# EAGLE design USBasp_smd05 (EAGLE 4.16)
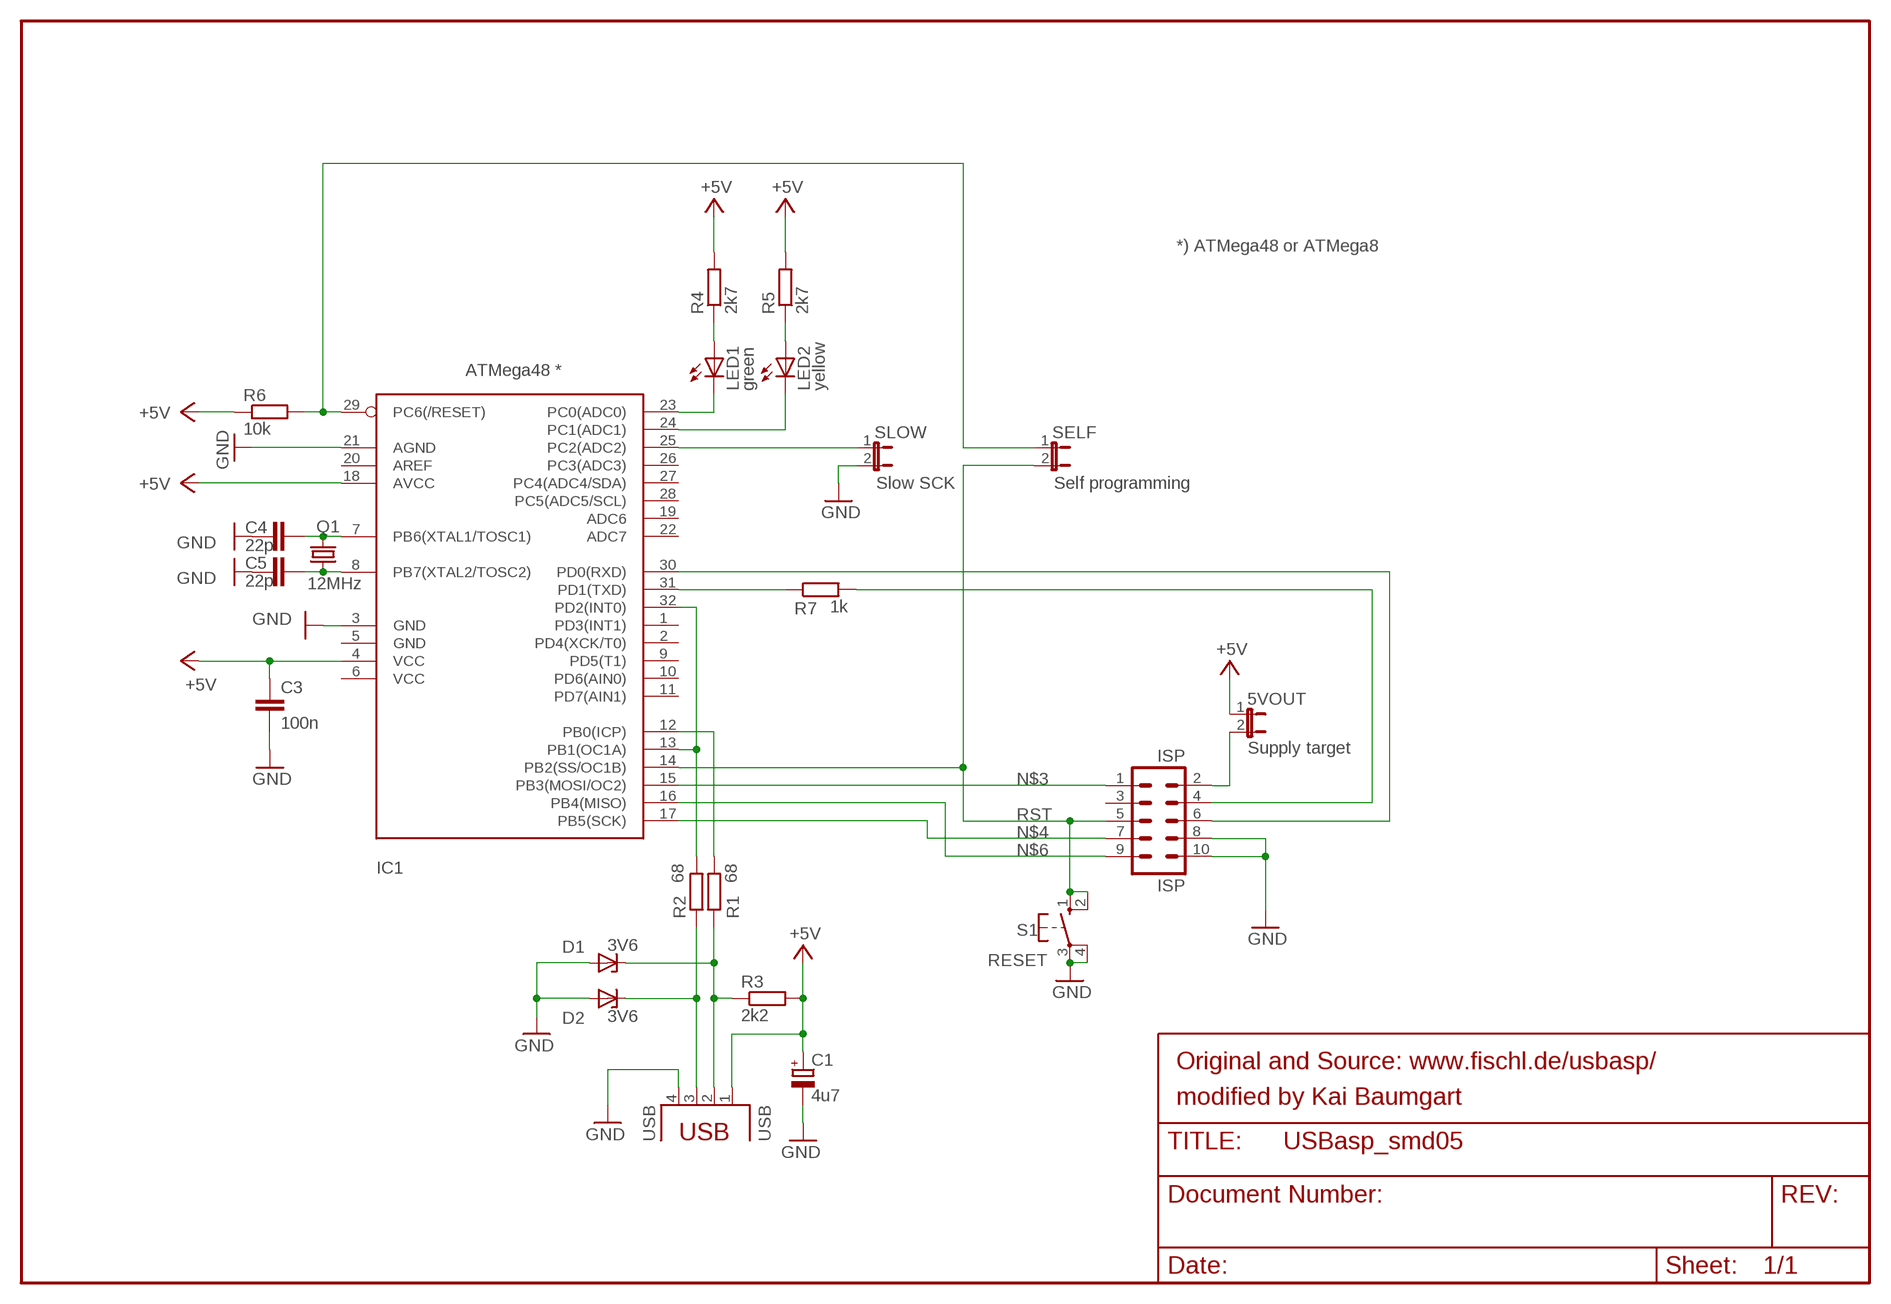
[diagram p0: schematic, sheet 1]

## Parts
5VOUT  Supply target  JP1E  [JP1]
C1  4u7  CPOL-EUE2.5-5  [E2,5-5]
C3  100n  C-EUC0603  [C0603]
C4  22p  C-EUC0603  [C0603]
C5  22p  C-EUC0603  [C0603]
D1  3V6  ZENER-DIODESOT23  [SOT23]
D2  3V6  ZENER-DIODESOT23  [SOT23]
IC1  ATMega48 *  MEGA8-AI  [TQFP32-08]
ISP  ISP  ML10L  [ML10L]
LED1  green  LEDCHIPLED_0603  [CHIPLED_0603]
LED2  yellow  LEDCHIPLED_0603  [CHIPLED_0603]
Q1  12MHz  CRYTALHC49S  [HC49/S]
R1  68  R-EU_R0805  [R0805]
R2  68  R-EU_R0805  [R0805]
R3  2k2  R-EU_R0805  [R0805]
R4  2k7  R-EU_R0805  [R0805]
R5  2k7  R-EU_R0805  [R0805]
R6  10k  R-EU_R0805  [R0805]
R7  1k  R-EU_R0805  [R0805]
S1  RESET  10-XX  [B3F-10XX]
SELF  Self programming  JP1E  [JP1]
SLOW  Slow SCK  JP1E  [JP1]
USB  USB  PN61729  [PN61729]

## Nets
+5V: 5VOUT.1 C1.+ C3.1 IC1.4(VCC) IC1.18(AVCC) R3.2 R4.2 R5.2 R6.1 USB.1
GND: C1.- C3.2 C4.1 C5.2 D1.1(A) D2.1(A) IC1.3(GND) IC1.21(AGND) ISP.8 ISP.10 S1.3(P) S1.4(P1) SLOW.2 USB.4
N$1: IC1.29(PC6(/RESET)) R6.2 SELF.1
N$3: IC1.15(PB3(MOSI/OC2)) ISP.1
N$4: IC1.17(PB5(SCK)) ISP.7
N$5: D1.3(C) R1.1 R3.1 USB.2
N$6: IC1.16(PB4(MISO)) ISP.9
N$7: IC1.13(PB1(OC1A)) IC1.32(PD2(INT0)) R2.2
N$8: D2.3(C) R2.1 USB.3
N$9: IC1.31(PD1(TXD)) R7.1
N$10: ISP.4 R7.2
N$11: IC1.30(PD0(RXD)) ISP.6
N$12: IC1.25(PC2(ADC2)) SLOW.1
N$13: LED1.A R4.1
N$14: IC1.23(PC0(ADC0)) LED1.C
N$15: IC1.24(PC1(ADC1)) LED2.C
N$16: LED2.A R5.1
N$17: 5VOUT.2 ISP.2
N$20: IC1.12(PB0(ICP)) R1.2
N$22: C4.2 IC1.7(PB6(XTAL1/TOSC1)) Q1.2
N$23: C5.1 IC1.8(PB7(XTAL2/TOSC2)) Q1.1
RST: IC1.14(PB2(SS/OC1B)) ISP.5 S1.1(S) S1.2(S1) SELF.2
Unconnected: IC1.1(PD3(INT1)) IC1.2(PD4(XCK/T0)) IC1.5(GND) IC1.6(VCC) IC1.9(PD5(T1)) IC1.10(PD6(AIN0)) IC1.11(PD7(AIN1)) IC1.19(ADC6) IC1.20(AREF) IC1.22(ADC7) IC1.26(PC3(ADC3)) IC1.27(PC4(ADC4/SDA)) IC1.28(PC5(ADC5/SCL)) ISP.3

## Notes on the sheet
- *) ATMega48 or ATMega8
- Original and Source: www.fischl.de/usbasp/
- modified by Kai Baumgart

## Library data of the parts
5VOUT SELF SLOW = jumper:JP1E: JUMPER
C1 = rcl:CPOL-EU: POLARIZED CAPACITOR, European symbol
C3-C5 = rcl:C-EU: CAPACITOR, European symbol
D1 D2 = diode:ZENER-DIODE: Z-Diode
IC1 = atmel:MEGA8: MICROCONTROLLER 8 Kbytes FLASH 1 kbytes SRAM 512 bytes EEPROM USART 6-channel 10 bit ADC 2-channel 8 bit ADC Source: avr.lbr
ISP = con-harting-ml:ML10: HARTING
LED1 LED2 = led:LED: LED OSRAM: - CHIPLED LG R971, LG N971, LY N971, LG Q971, LY Q971, LO R971, LY R971 LH N974, LH R974 LS Q976, LO Q976, LY Q976 LO Q996 - Hyper CHIPLED LW Q18S LB Q993, LB Q99A, LB R99A - SideLED LS A670, LO A670, LY A670, LG A670, LP A670 LB A673, LV A673, LT A673, LW A673 LH A674 LY A675 LS A676, LA A676, LO A676, LY A676, LW A676 LS A679, LY A679, LG A679 - Hyper Micro SIDELED® LS Y876, LA Y876, LO Y876, LY Y876 LT Y87S - SmartLED LW L88C, LW L88S LB L89C, LB L89S, LG L890 LS L89K, LO L89K, LY L89K LS L896, LA L896, LO L896, LY L896 - TOPLED LS T670, LO T670, LY T670, LG T670, LP T670 LSG T670, LSP T670, LSY T670, LOP T670, LYG T670 LG T671, LOG T671, LSG T671 LB T673, LV T673, LT T673, LW T673 LH T674 LS T676, LA T676, LO T676, LY T676, LB T676, LH T676, LSB T676, LW T676 LB T67C, LV T67C, LT T67C, LS T67K, LO T67K, LY T67K, LW E67C LS E67B, LA E67B, LO E67B, LY E67B, LB E67C, LV E67C, LT E67C LW T67C LS T679, LY T679, LG T679 LS T770, LO T770, LY T770, LG T770, LP T770 LB T773, LV T773, LT T773, LW T773 LH T774 LS E675, LA E675, LY E675, LS T675 LS T776, LA T776, LO T776, LY T776, LB T776 LHGB T686 LT T68C, LB T68C - Hyper Mini TOPLED® LB M676 - Mini TOPLED Santana® LG M470 LS M47K, LO M47K, LY M47K Source: http://www.osram.convergy.de/
Q1 = crystal:CRYTAL: CRYSTAL
R1-R7 = rcl:R-EU_: RESISTOR, European symbol
S1 = switch-omron:10-XX: OMRON SWITCH
USB = con-berg:PN61729: BERG USB connector

## Board
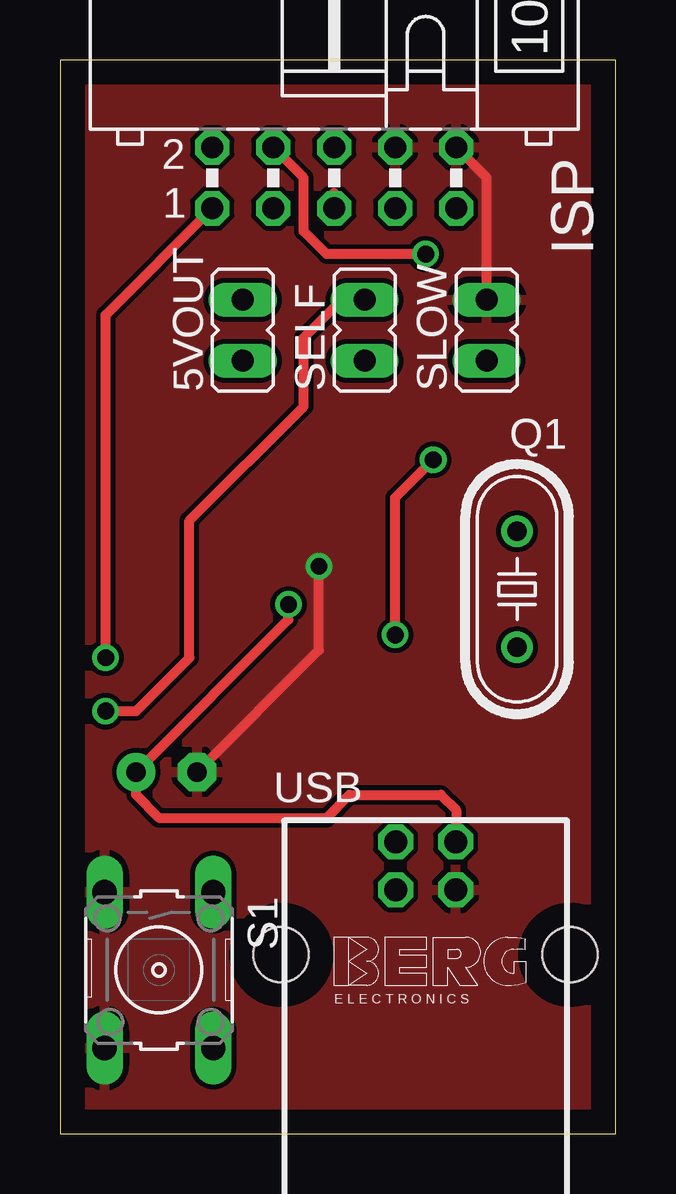
[diagram p1: board, top side]
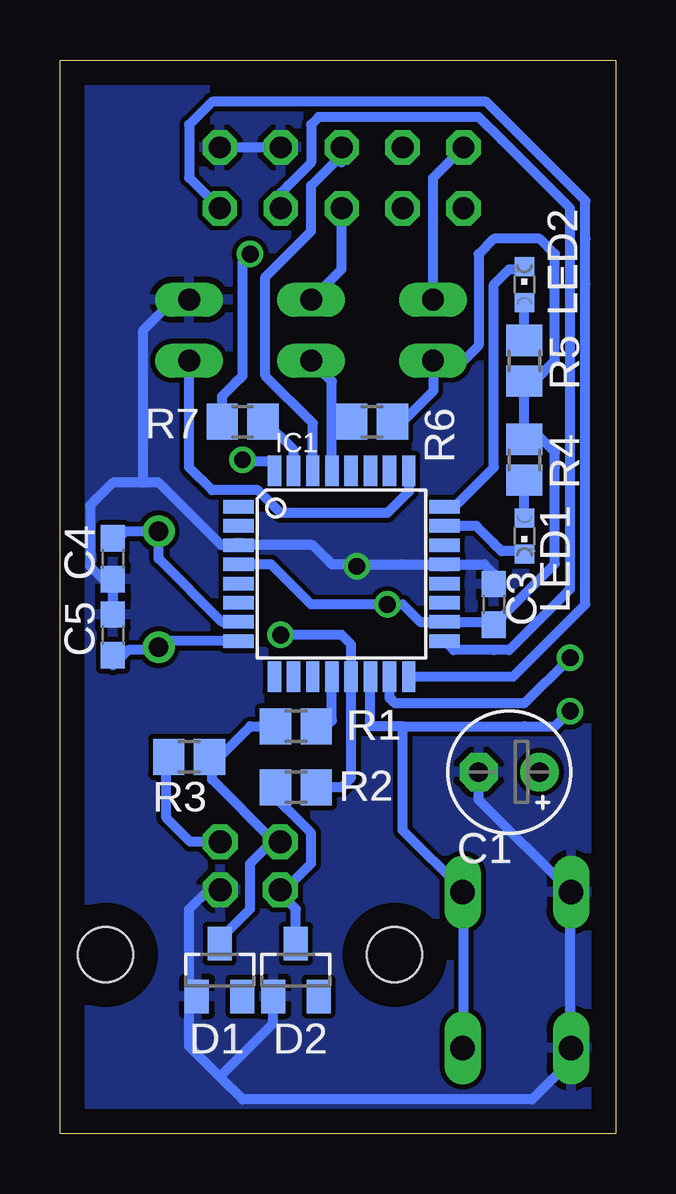
[diagram p2: board, bottom side, seen from below]

Size 23.16 x 44.75 mm. Coordinates in mm from the lower left corner, seen from the top.
Outline: 0,0 23.16,0 23.16,44.75 0,44.75 0,0
Copper layers (1*16): Top 0.035mm / dielectric 1.5mm / Bottom 0.035mm
Design rules "olimex_8mils": minimum track width 10mil, minimum drill 24mil, track to track 8mil, track to pad 8mil, pad to pad 8mil, via to via 8mil, smd to smd 8mil, copper to edge 40mil, drill to drill 10mil, minimum pad ring 10mil, minimum via ring 8mil, stop-mask expansion 0mil, vias tented up to drill 0mil, thermal gap 10mil

### Footprints (pad centres in the part's own frame; a part is rotated, then mirrored left to right if it is on the bottom)
JP1 = drill 0.914 long: 1 0,-1.27; 2 0,1.27
E2,5-5 = drill 0.813 pad 1.6 round: + -1.27,0 | drill 0.813 pad 1.6 octagon: - 1.27,0
C0603 = smd 1.1 x 1: 1 -0.85,0; 2 0.85,0
SOT23 = smd 1 x 1.4: 1 -0.95,-1.1; 2 0.95,-1.1; 3 0,1.1
TQFP32-08 = smd 1.27 x 0.559: 1 -4.293,2.8; 2 -4.293,2; 3 -4.293,1.2; 4 -4.293,0.4; 5 -4.293,-0.4; 6 -4.293,-1.2; 7 -4.293,-2; 8 -4.293,-2.8; 17 4.293,-2.8; 18 4.293,-2; 19 4.293,-1.2; 20 4.293,-0.4; 21 4.293,0.4; 22 4.293,1.2; 23 4.293,2; 24 4.293,2.8 | smd 0.559 x 1.27: 9 -2.8,-4.293; 10 -2,-4.293; 11 -1.2,-4.293; 12 -0.4,-4.293; 13 0.4,-4.293; 14 1.2,-4.293; 15 2,-4.293; 16 2.8,-4.293; 25 2.8,4.293; 26 2,4.293; 27 1.2,4.293; 28 0.4,4.293; 29 -0.4,4.293; 30 -1.2,4.293; 31 -2,4.293; 32 -2.8,4.293
ML10L = drill 0.914 octagon: 1 -5.08,-1.27; 2 -5.08,1.27; 3 -2.54,-1.27; 4 -2.54,1.27; 5 0,-1.27; 6 0,1.27; 7 2.54,-1.27; 8 2.54,1.27; 9 5.08,-1.27; 10 5.08,1.27
CHIPLED_0603 = smd 0.8 x 0.8: A 0,-0.75; C 0,0.75
HC49/S = drill 0.813 round: 1 -2.413,0; 2 2.413,0
R0805 = smd 1.3 x 1.5: 1 -0.85,0; 2 0.85,0
B3F-10XX = drill 1.016 long: 1 -3.251,2.261; 2 3.251,2.261; 3 -3.251,-2.261; 4 3.251,-2.261
PN61729 = drill 0.95 octagon: 1 1.25,4.71; 2 -1.25,4.71; 3 -1.25,2.71; 4 1.25,2.71 | hole 2.3: -6.02,0; 6.02,0

### Placement (x,y rotation side)
5VOUT  7.62,33.49 0 top
C1  4.44,15.08 180 bottom
C3  5.08,22.06 90 bottom
C4  20.95,23.96 90 bottom
C5  20.95,20.79 90 bottom
D1  16.5,6.82 0 bottom
D2  13.33,6.82 0 bottom
IC1  11.42,23.33 0 bottom
ISP  11.42,39.84 0 top
LED1  3.81,24.92 180 bottom
LED2  3.81,35.39 0 bottom
Q1  19.04,22.7 90 top
R1  13.33,16.98 0 bottom
R2  13.33,14.44 0 bottom
R3  17.77,15.71 180 bottom
R4  3.81,28.09 90 bottom
R5  3.81,32.22 270 bottom
R6  10.15,29.68 180 bottom
R7  15.55,29.68 180 bottom
S1  4.12,6.82 270 top
SELF  12.7,33.49 0 top
SLOW  17.77,33.49 0 top
USB  15.23,7.46 0 top

### Tracks (layer width: path | path; a pad name or v marks a point on that pad's centre or on a via)
+5V  (via drill 0.7)
  Top 0.406: v9.52,22.06 9.52,21.43 C1.+ 3.17,14.12 4.12,13.17 11.11,13.17 12.06,14.12 15.87,14.12 16.5,13.49 16.5,12.54 16.19,12.22 16.24,12.16 USB.1
  Bottom 0.406: IC1.4 14.37,23.73 12.7,22.06 11.42,22.06 v9.52,22.06 8.88,22.06 8.25,21.43 8.15,21.33 IC1.18 5.17,21.33 5.08,21.43 C3.1 2.53,23.75 2.53,27.14 2.53,27.78 2.53,28.41 3.17,29.05 3.81,29.05 | 18.41,15.71 R3.2 18.73,15.71 18.73,13.17 17.72,12.16 USB.1 16.48,11.92 16.5,11.9 | R6.1 8.88,29.68 7.62,30.95 5VOUT.1 6.35,32.22 5.71,32.85 5.71,36.66 5.08,37.3 3.17,37.3 2.53,36.66 2.53,35.39 2.53,32.22 3.39,31.37 R5.2 3.81,31.27 3.81,29.05 | C1.+ 2.85,15.08 | 3.81,29.05 R4.2
GND  (via drill 0.7)
  Top 0.406: C1.- 10.79,20.16 v10.79,23.65 | SLOW.2 17.77,39.84 ISP.10
  Bottom 0.406: 10.79,23.73 8.88,23.73 IC1.21 5.48,23.73 5.08,23.33 5.08,22.7 C3.2 | 10.79,23.73 11.82,23.73 12.06,23.96 12.62,24.53 IC1.3 16.43,24.53 17.77,25.87 19.04,27.14 19.68,27.14 | 16.5,9.99 16.48,10.01 USB.4 16.97,10.16 17.77,9.36 17.77,5.55 | 16.5,2.38 17.77,3.65 17.77,5.55 | D1.1 17.61,5.72 17.77,5.55 | D2.1 14.28,4.6 16.5,2.38 | C4.1 20.95,23.33 C4.1 | 20.95,22.7 C5.2 | 20.95,22.7 C4.1 | ISP.10 ISP.8 | SLOW.2 17.14,34.76 18.41,34.76 19.68,33.49 19.68,27.14 | 1.9,3.33 1.9,3.53 S1.4 | S1.4 1.9,3.61 | 1.9,3.61 1.9,3.65 | 1.9,3.65 1.9,9.99 1.9,10.03 S1.3 5.71,13.92 C1.- | v10.79,23.65 10.79,23.73 | 19.68,27.14 20.95,27.14 21.59,26.51 21.9,26.19 21.9,23.65 20.95,22.7 | 20.95,22.7 C4.1 | 16.5,2.38 15.55,1.42 3.49,1.42 1.9,3.01 1.9,3.65 | 1.9,3.61 1.9,3.65 | S1.4 1.9,3.61
  pour Bottom: -0.01,44.6 -0.01,0.15 23.17,0.15 23.17,44.6
  pour Top: -0.01,44.92 -0.01,0.15 23.17,0.15 23.17,44.92
N$1
  Bottom 0.406: IC1.29 11.82,29.68 | 11.82,29.68 11.82,31.35 SELF.1 | 11.82,29.68 11.42,29.68 R6.2
N$3  (via drill 0.7)
  Top 0.406: v1.9,19.84 1.9,32.85 1.9,34.12 ISP.1
  Bottom 0.406: IC1.15 9.42,18.16 9.2,17.93 8.25,17.93 4.12,17.93 3.81,17.93 v1.9,19.84
N$4
  Bottom 0.406: IC1.17 6.76,20.16 5.08,20.16 4.44,20.16 1.9,22.7 1.9,34.76 1.9,36.98 1.9,38.57 4.76,41.43 5.71,42.38 12.38,42.38 12.7,42.06 12.7,40.47 13.65,39.52 13.96,39.2 ISP.7
N$5
  Bottom 0.406: R1.1 13.96,16.98 14.6,16.98 15.23,16.98 16.5,15.71 | 16.82,15.71 R3.1 | 16.82,15.71 16.5,15.71 | 16.82,15.71 R3.1 | 16.82,15.71 16.5,15.71 | D1.3 16.5,8.09 15.23,9.36 15.23,11.26 14.33,12.16 USB.2 14.23,12.16 16.82,14.76 16.82,15.71 | 16.82,15.71 R3.1
N$6
  Bottom 0.406: IC1.16 4.29,19.04 1.27,22.06 1.27,35.39 1.27,37.3 1.27,38.89 5.39,43.02 16.82,43.02 17.77,42.06 17.77,39.84 ISP.9
N$7  (via drill 0.7)
  Top 0.406: v15.55,28.09 13.96,26.51 v13.96,20.79
  Bottom 0.406: R2.2 12.7,14.44 11.42,14.44 11.02,14.84 IC1.13 11.02,20.39 11.42,20.79 v13.96,20.79 | 14.22,28.04 IC1.32 14.22,28.04 | 14.22,28.04 15.5,28.04 v15.55,28.09
N$8
  Bottom 0.406: 14.6,14.44 R2.1 14.6,14.44 | D2.3 13.33,9.36 13.96,9.99 13.98,10.01 USB.3 13.79,10.16 12.7,11.26 12.7,12.54 14.6,14.44
N$9
  Bottom 0.406: R7.1 14.6,29.68 13.42,28.51 IC1.31
N$10  (via drill 0.7)
  Top 0.406: v15.23,36.66 12.38,36.66 11.11,36.66 10.15,37.62 10.15,39.84 ISP.4
  Bottom 0.406: R7.2 16.4,30.74 15.87,31.27 15.55,31.59 15.55,36.35 v15.23,36.66
N$11
  Bottom 0.406: IC1.30 12.62,29.61 14.6,31.59 14.6,35.71 13.96,36.35 12.7,37.62 12.7,39.52 11.42,40.79 | 11.42,40.79 ISP.6 11.42,40.79 | 11.42,40.79 11.42,40.47
N$12
  Bottom 0.406: IC1.25 8.62,26.77 8.88,26.51 9.52,25.87 13.96,25.87 14.92,26.82 16.82,26.82 17.77,27.78 17.77,29.05 SLOW.1
N$13
  Bottom 0.406: R4.1 3.81,27.14 LED1.A
N$14
  Bottom 0.406: IC1.23 5.81,25.33 5.08,24.6 4.76,24.28 3.81,24.28 LED1.C
N$15
  Bottom 0.406: IC1.24 6.72,26.13 5.08,27.78 5.08,35.39 4.44,36.03 3.81,36.03 LED2.C
N$16
  Bottom 0.406: LED2.A 3.81,34.76 R5.1
N$17
  Bottom 0.406: 5VOUT.2 7.62,36.35 7.62,37.62 7.62,39.84 ISP.2
N$20
  Bottom 0.406: R1.2 12.06,16.98 11.82,17.21 IC1.12
N$22
  Bottom 0.406: 19.04,25.24 Q1.2 | 19.04,25.24 Q1.2 | C4.2 20.95,24.6 20.44,25.11 Q1.2 | IC1.7 16.41,21.33 19.04,23.96 19.04,25.24 | 19.04,25.24 Q1.2
N$23
  Bottom 0.406: 19.04,20.16 Q1.1 | IC1.8 18.67,20.53 19.04,20.16 | C5.1 20.95,19.52 20.31,20.16 19.04,20.16
RST  (via drill 0.7)
  Top 0.406: ISP.5 11.42,39.2 | SELF.2 11.74,34.76 10.15,33.17 10.15,30.32 5.39,25.55 5.39,19.84 3.17,17.62 v1.9,17.62
  Bottom 0.406: S1.2 6.35,3.61 6.35,9.99 6.35,10.03 S1.1 6.35,10.11 8.88,12.65 8.88,16.98 | 8.88,16.98 3.81,16.98 2.53,16.98 v1.9,17.62 | 8.88,16.98 10.15,16.98 10.22,16.98 IC1.14 | SELF.2 11.42,36.03 ISP.5

### Text on the board
_tNames: ISP | 5VOUT | SELF | SLOW | Q1 | USB | S1
_bNames: LED2 | R5 | R7 | R4 | IC1 | R6 | LED1 | C4 | C3 | C5 | R1 | R3 | R2 | C1 | D2 | D1
_tValues: ISP | USB